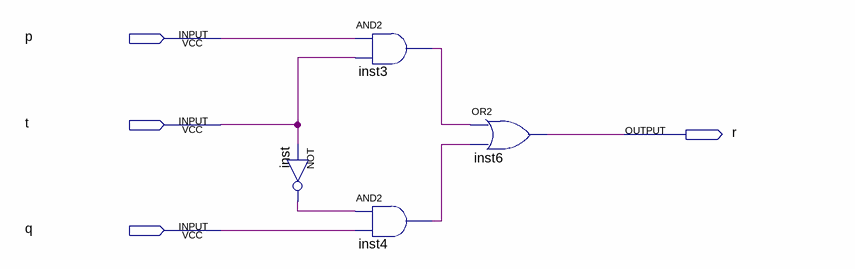
[diagram p0: schematic sheet]
// Quartus schematic selector.bdf as structural Verilog: 4 symbols, 4 pins
module selector (
  input  p,
  input  t,
  input  q,
  output r
);

  wire inst3_out, inst4_out, inst_out;

  not inst (inst_out, t);
  and inst3 (inst3_out, p, t);
  and inst4 (inst4_out, inst_out, q);
  or inst6 (r, inst3_out, inst4_out);
endmodule
